# Altium schematic sheet DDR3.SchDoc
size A; SheetNumber: 3; SheetTotal: 3
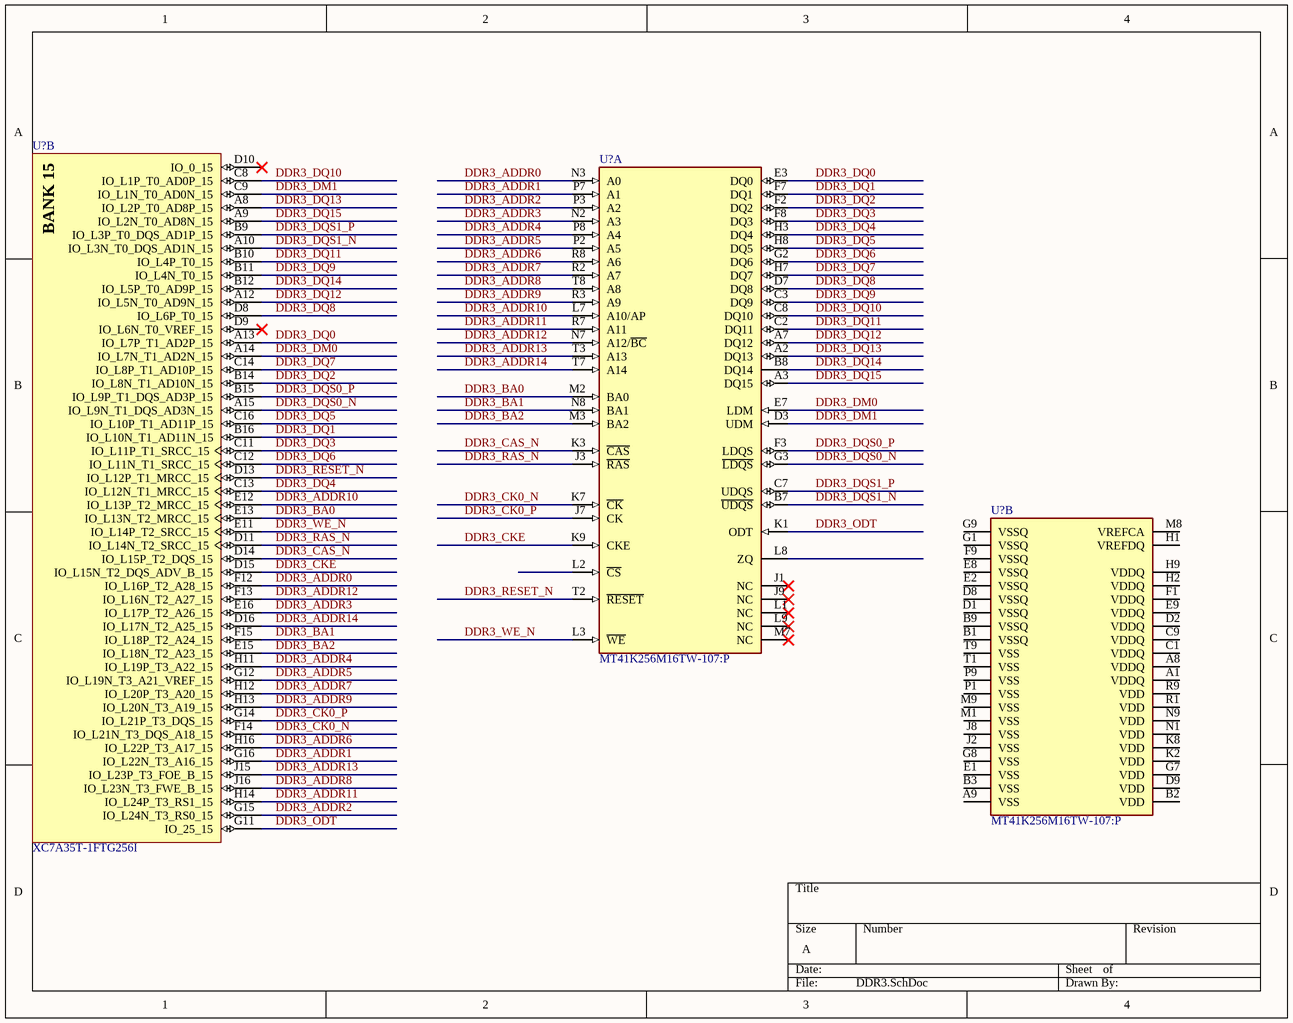
[diagram p0: DDR3.SchDoc]

## Parts
(Parts that share a designator on the sheet are numbered #1, #2 ... from top to bottom, then left to right.)
U?#1  XC7A35T-1FTG256I  [FTG256]  (part B of 8)
U?#2  MT41K256M16TW-107:P  [FP-TW-IPC_C]  (part A of 2)
U?#3  MT41K256M16TW-107:P  [FP-TW-IPC_C]  (part B of 2)

## Nets
DDR3_ADDR0: U?#1.F12(IO_L16P_T2_A28_15) U?#2.N3(A0)
DDR3_ADDR1: U?#1.G16(IO_L22N_T3_A16_15) U?#2.P7(A1)
DDR3_ADDR2: U?#1.G15(IO_L24N_T3_RS0_15) U?#2.P3(A2)
DDR3_ADDR3: U?#1.E16(IO_L17P_T2_A26_15) U?#2.N2(A3)
DDR3_ADDR4: U?#1.H11(IO_L19P_T3_A22_15) U?#2.P8(A4)
DDR3_ADDR5: U?#1.G12(IO_L19N_T3_A21_VREF_15) U?#2.P2(A5)
DDR3_ADDR6: U?#1.H16(IO_L22P_T3_A17_15) U?#2.R8(A6)
DDR3_ADDR7: U?#1.H12(IO_L20P_T3_A20_15) U?#2.R2(A7)
DDR3_ADDR8: U?#1.J16(IO_L23N_T3_FWE_B_15) U?#2.T8(A8)
DDR3_ADDR9: U?#1.H13(IO_L20N_T3_A19_15) U?#2.R3(A9)
DDR3_ADDR10: U?#1.E12(IO_L13P_T2_MRCC_15) U?#2.L7(A10/AP)
DDR3_ADDR11: U?#1.H14(IO_L24P_T3_RS1_15) U?#2.R7(A11)
DDR3_ADDR12: U?#1.F13(IO_L16N_T2_A27_15) U?#2.N7(A12/~{BC})
DDR3_ADDR13: U?#1.J15(IO_L23P_T3_FOE_B_15) U?#2.T3(A13)
DDR3_ADDR14: U?#1.D16(IO_L17N_T2_A25_15) U?#2.T7(A14)
DDR3_BA0: U?#1.E13(IO_L13N_T2_MRCC_15) U?#2.M2(BA0)
DDR3_BA1: U?#1.F15(IO_L18P_T2_A24_15) U?#2.N8(BA1)
DDR3_BA2: U?#1.E15(IO_L18N_T2_A23_15) U?#2.M3(BA2)
DDR3_CAS_N: U?#1.D14(IO_L15P_T2_DQS_15) U?#2.K3(~{CAS})
DDR3_CK0_N: U?#1.F14(IO_L21N_T3_DQS_A18_15) U?#2.K7(~{CK})
DDR3_CK0_P: U?#1.G14(IO_L21P_T3_DQS_15) U?#2.J7(CK)
DDR3_CKE: U?#1.D15(IO_L15N_T2_DQS_ADV_B_15) U?#2.K9(CKE)
DDR3_DM0: U?#1.A14(IO_L7N_T1_AD2N_15) U?#2.E7(LDM)
DDR3_DM1: U?#1.C9(IO_L1N_T0_AD0N_15) U?#2.D3(UDM)
DDR3_DQ0: U?#1.A13(IO_L7P_T1_AD2P_15) U?#2.E3(DQ0)
DDR3_DQ1: U?#1.B16(IO_L10N_T1_AD11N_15) U?#2.F7(DQ1)
DDR3_DQ2: U?#1.B14(IO_L8N_T1_AD10N_15) U?#2.F2(DQ2)
DDR3_DQ3: U?#1.C11(IO_L11P_T1_SRCC_15) U?#2.F8(DQ3)
DDR3_DQ4: U?#1.C13(IO_L12N_T1_MRCC_15) U?#2.H3(DQ4)
DDR3_DQ5: U?#1.C16(IO_L10P_T1_AD11P_15) U?#2.H8(DQ5)
DDR3_DQ6: U?#1.C12(IO_L11N_T1_SRCC_15) U?#2.G2(DQ6)
DDR3_DQ7: U?#1.C14(IO_L8P_T1_AD10P_15) U?#2.H7(DQ7)
DDR3_DQ8: U?#1.D8(IO_L6P_T0_15) U?#2.D7(DQ8)
DDR3_DQ9: U?#1.B11(IO_L4N_T0_15) U?#2.C3(DQ9)
DDR3_DQ10: U?#1.C8(IO_L1P_T0_AD0P_15) U?#2.C8(DQ10)
DDR3_DQ11: U?#1.B10(IO_L4P_T0_15) U?#2.C2(DQ11)
DDR3_DQ12: U?#1.A12(IO_L5N_T0_AD9N_15) U?#2.A7(DQ12)
DDR3_DQ13: U?#1.A8(IO_L2P_T0_AD8P_15) U?#2.A2(DQ13)
DDR3_DQ14: U?#1.B12(IO_L5P_T0_AD9P_15) U?#2.B8(DQ14)
DDR3_DQ15: U?#1.A9(IO_L2N_T0_AD8N_15) U?#2.A3(DQ15)
DDR3_DQS0_N: U?#1.A15(IO_L9N_T1_DQS_AD3N_15) U?#2.G3(~{LDQS})
DDR3_DQS0_P: U?#1.B15(IO_L9P_T1_DQS_AD3P_15) U?#2.F3(LDQS)
DDR3_DQS1_N: U?#1.A10(IO_L3N_T0_DQS_AD1N_15) U?#2.B7(~{UDQS})
DDR3_DQS1_P: U?#1.B9(IO_L3P_T0_DQS_AD1P_15) U?#2.C7(UDQS)
DDR3_ODT: U?#1.G11(IO_25_15) U?#2.K1(ODT)
DDR3_RAS_N: U?#1.D11(IO_L14N_T2_SRCC_15) U?#2.J3(~{RAS})
DDR3_RESET_N: U?#1.D13(IO_L12P_T1_MRCC_15) U?#2.T2(~{RESET})
DDR3_WE_N: U?#1.E11(IO_L14P_T2_SRCC_15) U?#2.L3(~{WE})

Not connected (* = marked no-connect by the designer): U?#1 D9(IO_L6N_T0_VREF_15)* D10(IO_0_15)*; U?#2 J1(NC)* J9(NC)* L1(NC)* L2(~{CS}) L8(ZQ) L9(NC)* M7(NC)*; U?#3 A1(VDDQ) A8(VDDQ) A9(VSS) B1(VSSQ) B2(VDD) B3(VSS) B9(VSSQ) C1(VDDQ) C9(VDDQ) D1(VSSQ) D2(VDDQ) D8(VSSQ) D9(VDD) E1(VSS) E2(VSSQ) E8(VSSQ) E9(VDDQ) F1(VDDQ) F9(VSSQ) G1(VSSQ) G7(VDD) G8(VSS) G9(VSSQ) H1(VREFDQ) H2(VDDQ) H9(VDDQ) J2(VSS) J8(VSS) K2(VDD) K8(VDD) M1(VSS) M8(VREFCA) M9(VSS) N1(VDD) N9(VDD) P1(VSS) P9(VSS) R1(VDD) R9(VDD) T1(VSS) T9(VSS)

## Notes on the sheet
- (in symbol CMP-0383-00026-1, part B) BANK 15

## Library data of the parts
U?#1 = CMP-0383-00026-1: Artix-7 FPGA, 170 User I/Os, 0 GTP, 256-Ball BGA, Speed Grade 1, Industrial Grade, Pb-Free; Manufacturer: Xilinx; Speed Grades: 1; Logic Cells: 33280; Available User I/O: 170; CMTs: 5; GTP: 0; Total Block RAM: 1800 Kb; ComponentLink3Description: Pinout; ComponentLink2Description: Datasheet; ComponentLink1Description: Manufacturer URL; DatasheetVersion: Rev. 1.15; ComponentLink4URL: http://www.xilinx.com/support/documentation/user_guides/ug475_7Series_Pkg_Pinout.pdf; ComponentLink4Description: Package Specification; ComponentLink1URL: http://www.xilinx.com/; PackageReference: FTG-256; Maximum Distributed RAM: 400 Kb; PartNumber: XC7A35T-1FTG256I; ComponentLink2URL: http://www.xilinx.com/support/documentation/data_sheets/ds180_7Series_Overview.pdf; Mounting Technology: Surface Mount; Operating Temperature Range: Industrial; PackageVersion: Rev. 1.11; ComponentLink3URL: http://www.xilinx.com/support/documentation/user_guides/ug475_7Series_Pkg_Pinout.pdf; PackageDescription: 256-Ball Wire-Bond Fine-Pitch Thin BGA, Body 17 x 17 mm, Pitch 1 mm
U?#2 U?#3 = CMP-2000-07475-2: IC DRAM 4G PARALLEL 96FBGA; Manufacturer: Micron; Access Time: 1.07ns; Nominal Supply Current: 12-156mA; Min Supply Voltage: 1.283V; Memory Type: SDRAM,DDR3; Standoff Height: 0.29mm; Max Supply Voltage: 1.45V; Memory Size: 4Gbits; Device Class L1: Integrated Circuits (ICs); Lead Free: Yes; ComponentLink2Description: Datasheet; Manufacturer Part Number: MT41K256M16TW-107:P; Category: IC; Digikey Description: IC DRAM 4G PARALLEL 96FBGA; Device Class L3: RAM; Interface: Parallel; RoHS: TRUE; Octopart: https://octopart.com/mt41k256m16tw-107%3Ap-micron-66533852; Temperature Range High: +85°C; ComponentLink2URL: https://www.micron.com/-/media/client/global/documents/products/data-sheet/dram/ddr3/4gb_ddr3l.pdf; Temperature: 0°C to +85°C; Package: TW; Device Class L2: Memory; Automotive: No; Height: 1.2mm; Temperature Range Low: 0°C